# Altium schematic sheet Sheet1.SchDoc
size A
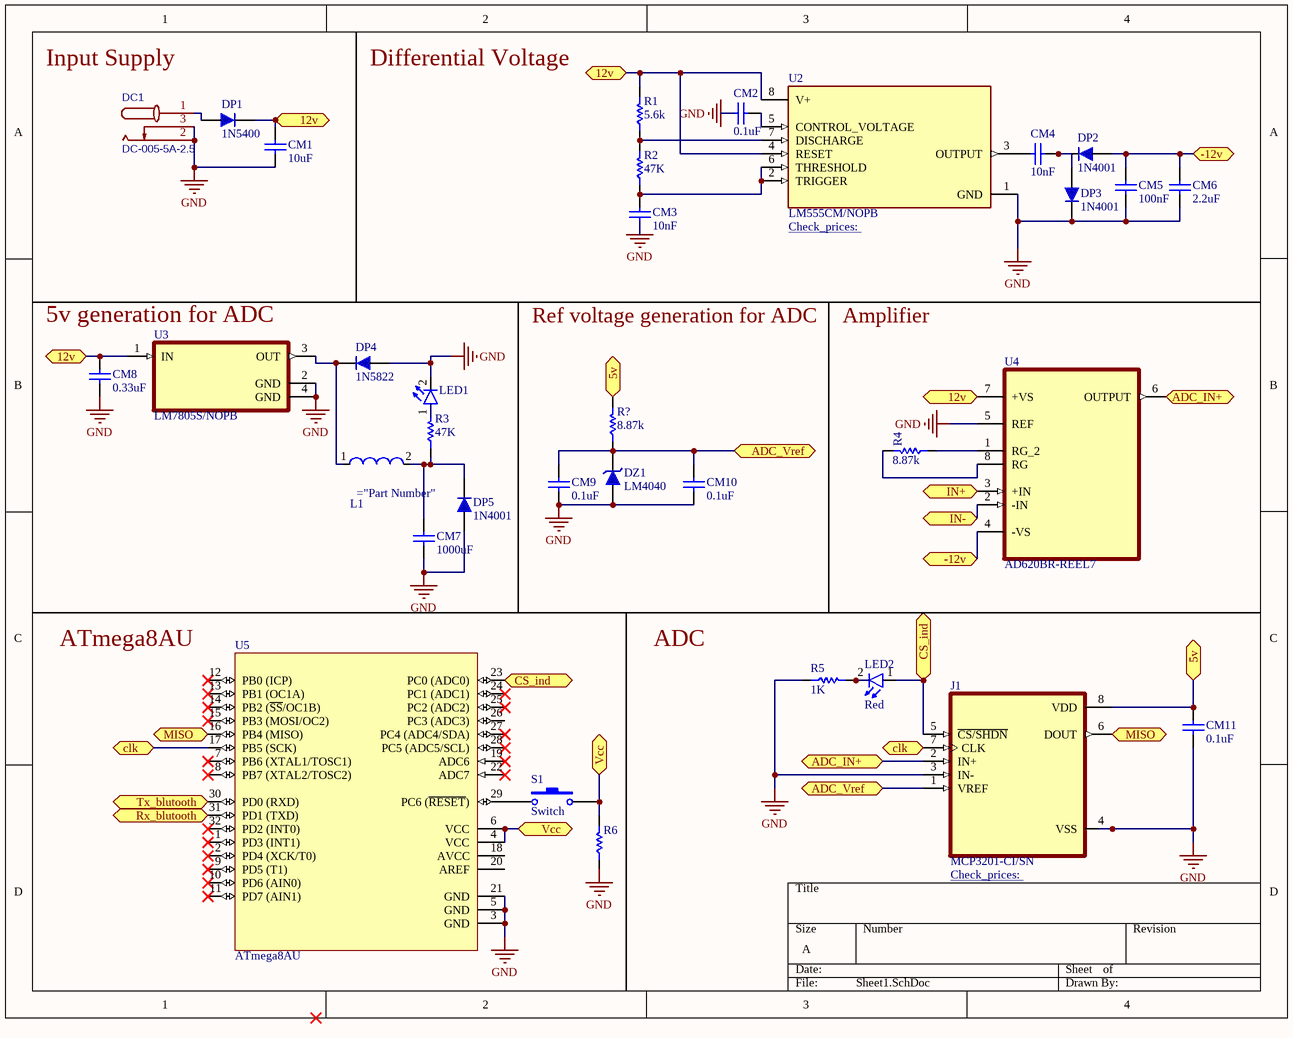
[diagram p0: Sheet1.SchDoc]

## Parts
CM1  10uF  [0603C]
CM2  0.1uF  [0603C]
CM3  10nF  [0603C]
CM4  10nF  [0603C]
CM5  100nF  [0603C]
CM6  2.2uF  [0603C]
CM7  1000uF  [0603C]
CM8  0.33uF  [0603C]
CM9  0.1uF  [0603C]
CM10  value 0.1uF  [0603C]  (hidden comment: 10uF)
CM11  value 0.1uF  [0603C]
DC1  DC-005-5A-2.5  [DC-005-5A-2.5]
DP1  1N5400  [430X270D]
DP2  1N4001  [430X270D]
DP3  1N4001  [430X270D]
DP4  1N5822  [430X270D]
DP5  1N4001  [430X270D]
DZ1  LM4040  [DO 35]
J1  MCP3201-CI/SN  [SOIC127P600X175-8N]
L1  CDRH74  (value not drawn)
LED1  green  [LED SMD 1206]  (value not drawn)
LED2  Color: Red  [LED SMD 1206]  (hidden comment: White)
R1  5.6k  [RES 0805 (2012X06L)]
R2  47K  [RES 0805 (2012X06L)]
R3  47K  [RES 0805 (2012X06L)]
R4  8.87k  [RES 0805 (2012X06L)]
R5  1K  [RES 0805 (2012X06L)]
R6  (no value)  [RES 0805 (2012X06L)]
R?  8.87k  [RES 0805 (2012X06L)]
S1  Switch  [Switch - Push to On]
U2  LM555CM/NOPB  [SOIC127P599X175-8N]
U3  LM7805S/NOPB  [TO254P1524X483-4N]
U4  AD620BR-REEL7  [SOIC127P600X175-8N]
U5  ATmega8AU  [32A_N]

## Ports
5v, 12v, -12v, ADC_IN+, ADC_Vref, clk, CS_ind, IN+, IN-, MISO, Rx_blutooth, Tx_blutooth, Vcc

## Nets
GND: CM1.1 CM2.1 CM3.1 CM5.1 CM6.1 CM7.1 CM8.2 CM9.1 CM10.1 CM11.1 DC1.2 DC1.3 DP3.2 DP4.1 DP5.1 DZ1.1 J1.3(IN-) J1.4(VSS) LED1.2(K) R5.1 R6.1 U2.1(GND) U3.2(GND) U3.4(GND) U4.5(REF) U5.3(GND) U5.5(GND) U5.21(GND)
5v: CM11.2 J1.8(VDD) R?.2 ; port 5v
12v: CM1.2 CM8.1 DP1.2 R1.2 U2.4(RESET) U2.8(V+) U3.1(IN) U4.7(+VS) ; port 12v
-12v: CM5.2 CM6.2 DP2.1 U4.4(-VS) ; port -12v
ADC_IN+: J1.2(IN+) U4.6(OUTPUT) ; port ADC_IN+
ADC_Vref: CM9.2 CM10.2 DZ1.2 J1.1(VREF) R?.1 ; port ADC_Vref
clk: J1.7(CLK) U5.17(PB5_(SCK)) ; port clk
CS_ind: J1.5(~{CS/SHDN}) LED2.1(A) U5.23(PC0_(ADC0)) ; port CS_ind
IN+: U4.3(+IN) ; port IN+
IN-: U4.2(-IN) ; port IN-
MISO: J1.6(DOUT) U5.16(PB4_(MISO)) ; port MISO
Rx_blutooth: U5.31(PD1_(TXD)) ; port Rx_blutooth
Tx_blutooth: U5.30(PD0_(RXD)) ; port Tx_blutooth
Vcc: R6.2 S1.2 U5.4(VCC) U5.6(VCC) ; port Vcc
NetCM2_2: CM2.2 U2.5(CONTROL_VOLTAGE)
NetCM3_2: CM3.2 R2.1 U2.2(TRIGGER) U2.6(THRESHOLD)
NetCM4_1: CM4.1 U2.3(OUTPUT)
NetCM4_2: CM4.2 DP2.2 DP3.1
NetCM7_2: CM7.2 DP5.2 L1.2(L2) R3.1
NetDC1_1: DC1.1 DP1.1
NetDP4_2: DP4.2 L1.1(L1) U3.3(OUT)
NetLED1_1: LED1.1(A) R3.2
NetLED2_2: LED2.2(K) R5.2
NetR1_1: R1.1 R2.2 U2.7(DISCHARGE)
NetR4_1: R4.1 U4.1(RG_2)
NetR4_2: R4.2 U4.8(RG)
NetS1_1: S1.1 U5.29(PC6_(~{RESET}))

Not connected (* = marked no-connect by the designer): U5 1(PD3_(INT1))* 2(PD4_(XCK/T0))* 7(PB6_(XTAL1/TOSC1))* 8(PB7_(XTAL2/TOSC2))* 9(PD5_(T1))* 10(PD6_(AIN0))* 11(PD7_(AIN1))* 12(PB0_(ICP))* 13(PB1_(OC1A))* 14(PB2_(~{SS}/OC1B))* 15(PB3_(MOSI/OC2))* 18(AVCC) 19(ADC6)* 20(AREF) 22(ADC7)* 24(PC1_(ADC1))* 25(PC2_(ADC2))* 26(PC3_(ADC3)) 27(PC4_(ADC4/SDA))* 28(PC5_(ADC5/SCL))* 32(PD2_(INT0))*

## Notes on the sheet
- Input Supply
- (near R1) Differential Voltage
- 5v generation for ADC
- Ref voltage generation for ADC
- Amplifier
- ATmega8AU
- ADC

## Library data of the parts
CM1-CM11 = Cap: Capacitor
  CM1: Value: 10uF
  CM2 CM9: Value: 0.1uF
  CM3 CM4: Value: 10nF
  CM5: Value: 100nF
  CM6: Value: 2.2uF
  CM7: Value: 1000uF
  CM8: Value: 0.33uF
DC1 = DC-005-5A-2.5: BOM_Manufacturer: XKB Enterprise; Contributor: LCSC; BOM_Supplier: LCSC; BOM_Supplier Part: C381115; BOM_Manufacturer Part: DC-005-5A-2.5; spicePre: D; spiceSymbolName: DC-005-5A-2.5
DP1-DP3 = 1N5819
DP4 DP5 = 1N5819_1: Schottkey Rectifiers; Designer: Abbas Basereh; Data: 16-12-2016; Link: *; Part. No: *
DZ1 = ZENER GENERAL DIODE: DIODE ZENER GENERAL; VALUE: 12V; Published: 2017-1-12; PackageVersion: 2017-1-12; PackageReference: DO 35; Publisher: Abbas Basereh; PackageDescription: DIODE GEN ZENER; ComponentLink1Description: Manufacturer Link; ComponentLink2Description: Datasheet
J1 = MCP3201-CI/SN: 12 Bit Analog to Digital Converter 1 Input 1 SAR 8-SOIC; MF: Microchip; SnapEDA_Link: https://www.snapeda.com/parts/MCP3201-CI/SN/Microchip/view-part/46724/?ref=snap; Price: None; MP: MCP3201-CI/SN; Availability: Unavailable; Value: *; Package: SOIC-8 Microchip
L1 = CDRH74NP-100MC
LED1 LED2 = LED: Designer: Saeid Jorablo; Organazation: ControTec; Adding Date: 1387/12/22
R1-R6 R? = Resistor
  R1: Value: 5.6k
  R2 R3: Value: 47K
  R4 R?: Value: 8.87k
  R5: Value: 1K
S1 = Switch PB: Push Button Switch
U2 = LM555CM/NOPB: Highly Stable 555 Timer 8-SOIC 0 to 70; MF: Texas Instruments; Package: SOIC-8 Texas Instruments; DigiKey-Purchase-URL: https://snapeda.com/shop?store=DigiKey&id=50124; Value: *; Mouser-Purchase-URL: https://snapeda.com/shop?store=Mouser&id=50124; Availability: Good; SnapEDA_Link: https://www.snapeda.com/parts/LM555CM/NOPB/Texas%20Instruments/view-part/50124/?ref=snap; MP: LM555CM/NOPB; Price: None; Arrow_Asia-Purchase-URL: https://snapeda.com/shop?store=Arrow+Asia&id=50124; Texas_Instruments-Purchase-URL: https://snapeda.com/shop?store=Texas+Instruments&id=50124
U3 = LM7805S/NOPB: 1.5-A, 30-V, linear voltage regulator 3-DDPAK/TO-263 0 to 125; MF: Texas Instruments; MP: LM7805S/NOPB; Value: *; SnapEDA_Link: https://www.snapeda.com/parts/LM7805S/NOPB/Texas%20Instruments/view-part/546227/?ref=snap; Price: None; Package: TO-263-3 Texas Instruments; DigiKey-Purchase-URL: https://snapeda.com/shop?store=DigiKey&id=546227; Texas_Instruments-Purchase-URL: https://snapeda.com/shop?store=Texas+Instruments&id=546227; Availability: Warning
U4 = AD620BR-REEL7: Instrumentation Amplifier 1 Circuit 8-SOIC; MF: Analog Devices; Price: None; Package: SOIC-8 Analog Devices; Availability: Unavailable; SnapEDA_Link: https://www.snapeda.com/parts/AD620BR/Analog%20Devices%20Inc./view-part/7466/?ref=snap; Value: *; MP: AD620BR
U5 = ATmega8L-8AI: 8-Bit AVR Microcontroller with 8K Bytes of In-System Programmable Flash Memory; Published: 2017-1-4; LatestRevisionDate: 16-Oct-2006; LatestRevisionNote: IPC-7351 Footprint Added.; DatasheetVersion: 2486H-AVR-09/02; PackageVersion: 2017-1-4; PackageReference: 32A; Publisher: Abbas Basereh; PackageDescription: 32-Lead, 7x7x1.0 mm Body, 0.8mm Lead Pitch, Thin Profile Plastic Quad Flat Package (TQFP); Supplier 1: Digi-Key; Supplier Part Number 1: ATMEGA8L-8AI-ND; Supplier 2: Farnell; Supplier Part Number 2: 3917952; Supplier 3: Mouser; Supplier Part Number 3: 556-ATMEGA8L-8AI; Code_JEDEC: MS-026-ABA; ComponentLink1Description: Datasheet; ComponentLink1URL: http://www.atmel.com/dyn/resources/prod_documents/doc2486.pdf; ComponentLink2Description: Atmel.com Home; ComponentLink2URL: http://www.atmel.com